# EAGLE design generator (EAGLE 7.2.0)
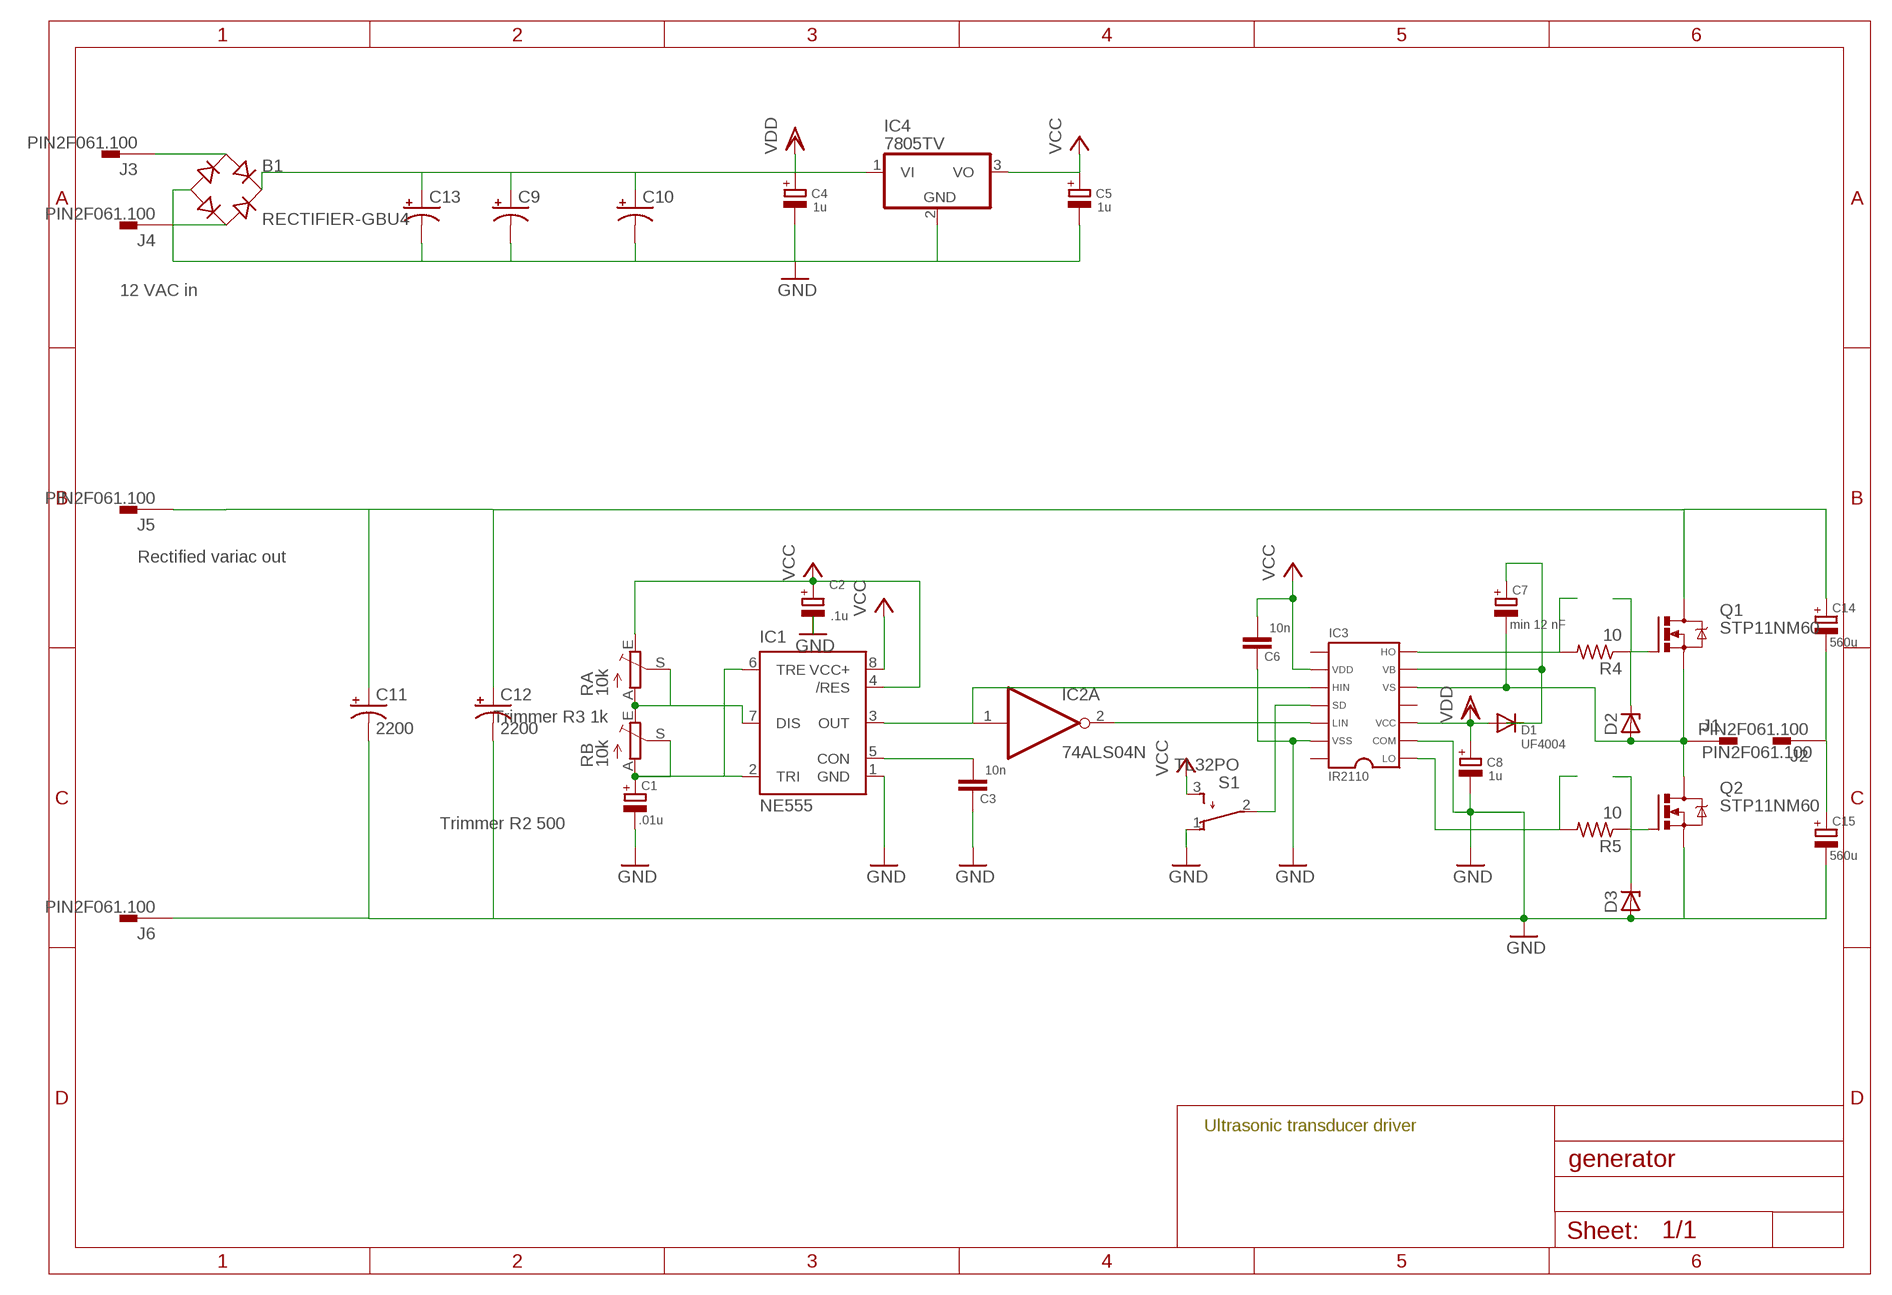
[diagram p0: schematic, sheet 1]

## Parts
B1  RECTIFIER-GBU4  [GBU4]
C1  .01u  CPOL-EUE5-8.5  [E5-8,5]
C2  .1u  CPOL-EUE5-8.5  [E5-8,5]
C3  10n  C-EU075-052X106  [C075-052X106]
C4  1u  CPOL-EUE5-8.5  [E5-8,5]
C5  1u  CPOL-EUE5-8.5  [E5-8,5]
C6  10n  C-EU075-052X106  [C075-052X106]
C7  min 12 nF  CPOL-EUE5-8.5  [E5-8,5]
C8  1u  CPOL-EUE5-8.5  [E5-8,5]
C9  CPOL-USE7.5-18  [E7,5-18]
C10  CPOL-USE7.5-18  [E7,5-18]
C11  2200  CPOL-USE10-35  [EB35D]
C12  2200  CPOL-USE10-35  [EB35D]
C13  CPOL-USE7.5-18  [E7,5-18]
C14  560u  CPOL-EUE7.5-16  [E7,5-16]
C15  560u  CPOL-EUE7.5-16  [E7,5-16]
D1  UF4004  DIODE-D-7.5  [D-7.5]
D2  ZENER-DIODEZD-10  [ZDIO-10]
D3  ZENER-DIODEZD-10  [ZDIO-10]
IC1  NE555  [DIL-08]
IC2  74ALS04N  [DIL14]
IC3  IR2110  [DIL14]
IC4  7805TV  [TO220V]
J1  PIN2F061.100  [F061.100]
J2  PIN2F061.100  [F061.100]
J3  PIN2F061.100  [F061.100]
J4  PIN2F061.100  [F061.100]
J5  PIN2F061.100  [F061.100]
J6  PIN2F061.100  [F061.100]
Q1  STP11NM60  IRF530  [TO220BV]
Q2  STP11NM60  IRF530  [TO220BV]
R4  10  R-US_0207/10  [0207/10]
R5  10  R-US_0207/10  [0207/10]
RA  10k  TRIM_EU-LI10  [LI10]
RB  10k  TRIM_EU-LI10  [LI10]
S1  TL32PO  [TL3XPO]

## Nets
GND: B1.- C1.- C2.- C3.1 C4.- C5.- C6.1 C8.- C9.- C10.- C11.- C12.- C13.- C15.- D3.A IC1.1(GND) IC3.2 IC3.13 IC4.2(GND) J6.A1 J6.A2 Q2.S S1.1(O)
HIN: IC1.3(OUT) IC2.1(A:I) IC3.10
HO: IC3.7 R4.2
LIN: IC2.2(A:O) IC3.12
LO: IC3.1 R5.2
N$1: C7.+ D1.C IC3.6
N$2: C1.+ IC1.2(TRI) IC1.6(TRE) RB.A RB.S
N$3: C3.2 IC1.5(CON)
N$6: C11.+ C12.+ C14.+ J5.A1 J5.A2 Q1.D
N$7: IC1.7(DIS) RA.A RA.S RB.E
N$8: C14.- C15.+ J2.A1 J2.A2
N$9: B1.AC2 J4.A1 J4.A2
N$10: B1.AC1 J3.A1 J3.A2
N$11: D3.C Q2.G R5.1
N$12: D2.C Q1.G R4.1
N$17: IC3.11 S1.2(P)
TRANS: C7.- D2.A IC3.5 J1.A1 J1.A2 Q1.S Q2.D
VCC: C2.+ C5.+ C6.2 IC1.4(/RES) IC1.8(VCC+) IC3.9 IC4.3(VO) RA.E S1.3(S)
VDD: B1.+ C4.+ C8.+ C9.+ C10.+ C13.+ D1.A IC3.3 IC4.1(VI)
Unconnected: IC2.3(B:I) IC2.4(B:O) IC2.5(C:I) IC2.6(C:O) IC2.8(D:O) IC2.9(D:I) IC2.10(E:O) IC2.11(E:I) IC2.12(F:O) IC2.13(F:I) IC3.4 IC3.8 IC3.14

## Notes on the sheet
- 12 VAC in
- Rectified variac out
- Trimmer R3 1k
- Trimmer R2 500
- Ultrasonic transducer driver

## Power pins joined to a net without a drawn wire
GND: IC2.7(P:GND)
VCC: IC2.14(P:VCC)

## Library data of the parts
B1 = rectifier:RECTIFIER-: Rectifier
C1 C2 C4 C5 C7 C8 C14 C15 = rcl:CPOL-EU: POLARIZED CAPACITOR, European symbol
C3 C6 = rcl:C-EU: CAPACITOR, European symbol
C9-C13 = resistor:CPOL-US: POLARIZED CAPACITOR, American symbol
D1 = diode:DIODE-: DIODE
D2 D3 = diode:ZENER-DIODE: Z-Diode
IC1 = st-microelectronics:NE555: General purpose bipolar Timer; MF: Arrow Electronics; MPN: NE555N; OC_FARNELL: 1467742; OC_NEWARK: 89K1486
IC2 = 74xx-us:74*04: Hex INVERTER
IC3 = lindsay-mosfet-driver:IR2110
IC4 = linear:78*: Positive VOLTAGE REGULATOR Source: http://cache.national.com/ds/LM/LM78L05.pdf http://www.fairchildsemi.com/ds/LM/LM7805.pdf
J1-J6 = con-faston:PIN2: Flachstecker Typ Tyco/Electronics/AMP TAB, FASTON Printed Circuit Board Tabs Source: http://www.buerklin.com, http://catalog.tycoelectronics.com; OC_FARNELL: unknown; OC_NEWARK: unknown
Q1 Q2 = transistor-power:IRF530: HEXFET Power MOSFET
R4 R5 = rcl:R-US_: RESISTOR, American symbol
RA RB = pot:TRIM_EU-: POTENTIOMETER
S1 = switch:TL32PO: TINY SWITCH ON - MOM Source: http://www2.produktinfo.conrad.com/datenblaetter/700000-724999/705152-da-01-de-Subminiaturschalter_TL_36YO.pdf

## Board
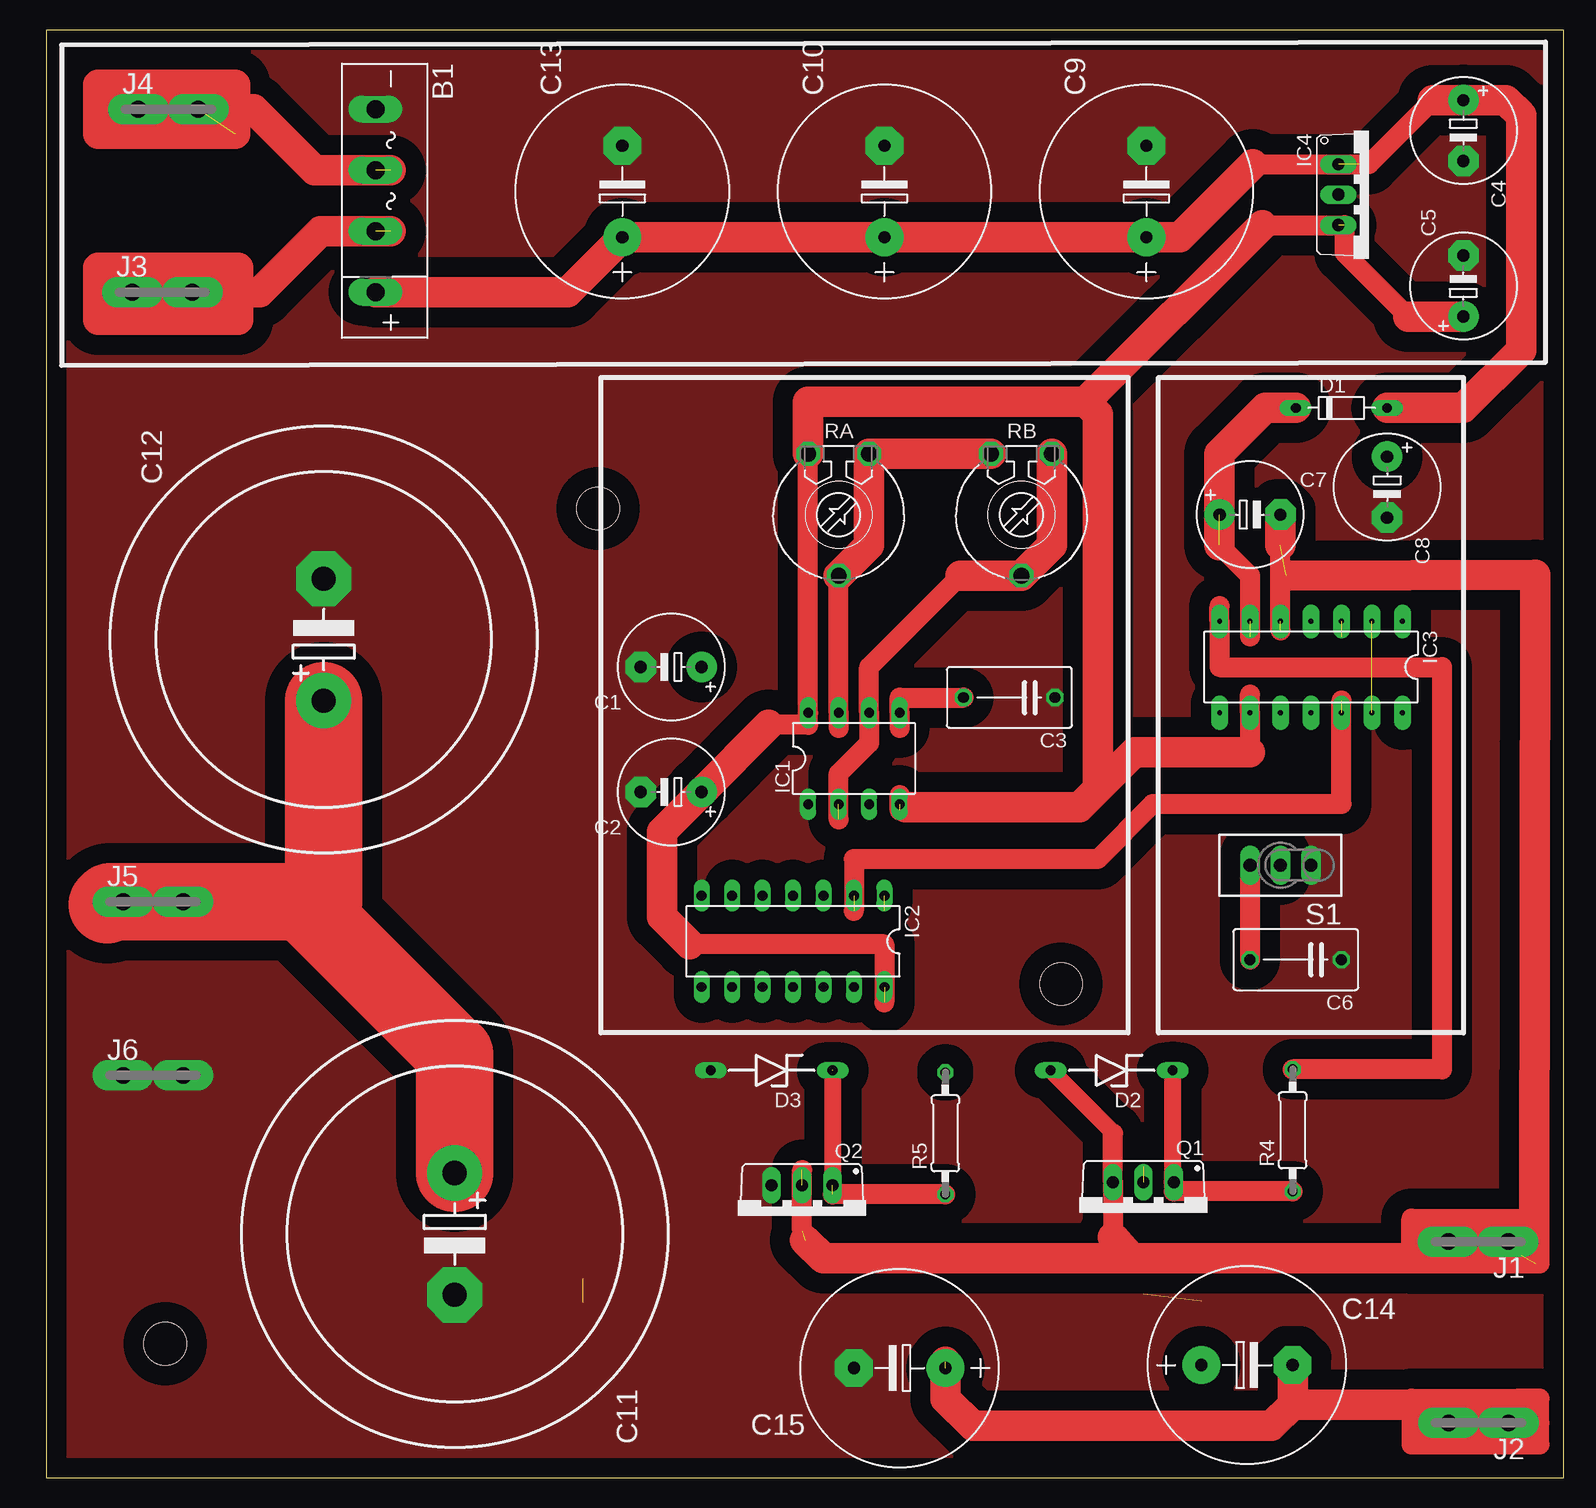
[diagram p1: board, top side]
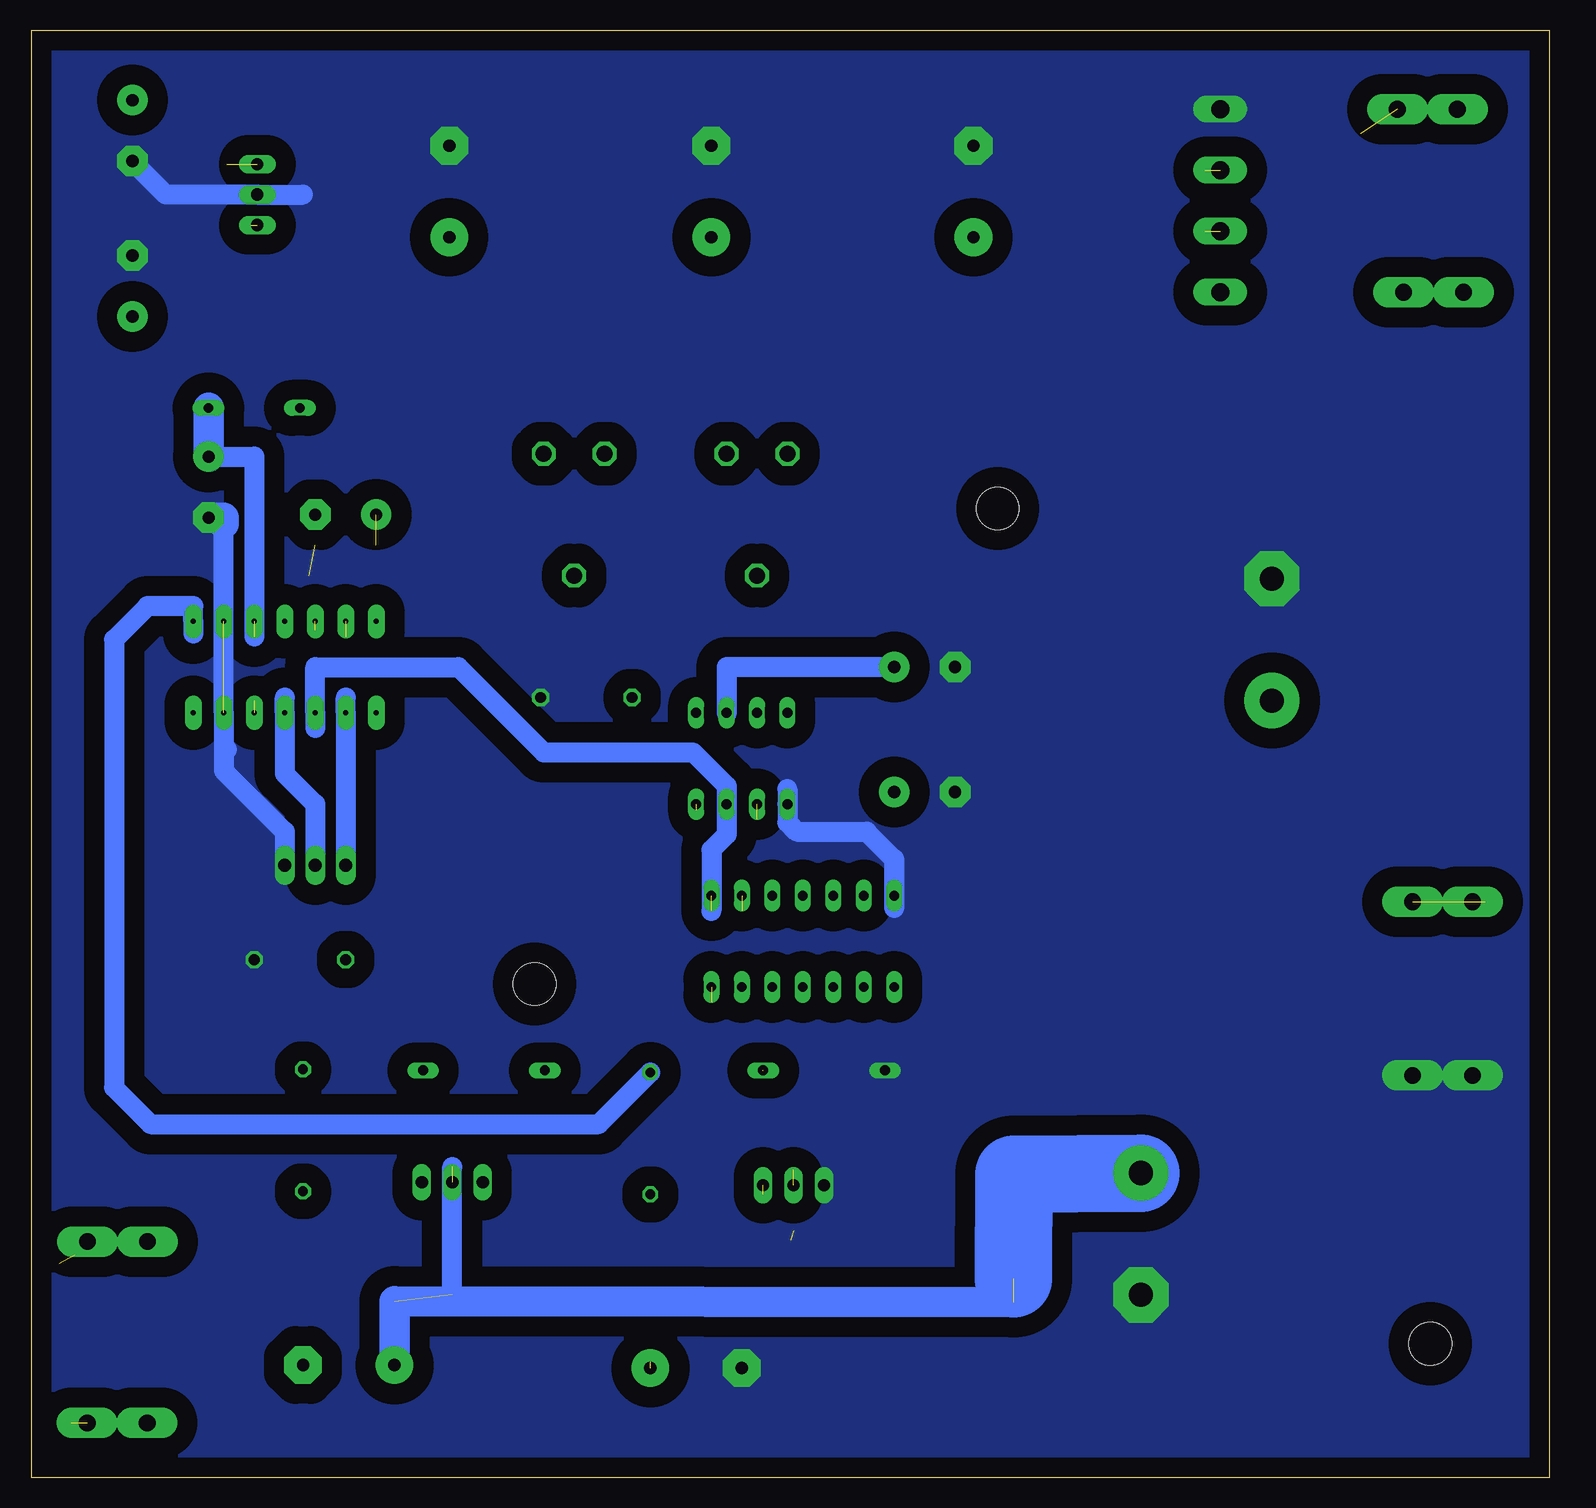
[diagram p2: board, bottom side, seen from below]

Size 126.49 x 120.65 mm. Coordinates in mm from the lower left corner, seen from the top.
Outline: 0,0 126.49,0 126.49,120.65 0,120.65 0,0
Copper layers (1*16): Top 0.035mm / dielectric 1.5mm / Bottom 0.035mm
Design rules "default *": minimum track width 10mil, minimum drill 24mil, track to track 8mil, track to pad 8mil, pad to pad 8mil, via to via 8mil, smd to smd 8mil, copper to edge 5mil, drill to drill 8mil, minimum pad ring 10mil, minimum via ring 8mil, stop-mask expansion 4mil, vias tented up to drill 0mil, thermal gap 10mil
Holes 3.56 mm at 9.91,11.18 45.97,80.77 84.58,41.15

### Footprints (pad centres in the part's own frame; a part is rotated, then mirrored left to right if it is on the bottom)
GBU4 = drill 1.499 long: + 7.62,0; - -7.62,0; AC1 2.54,0; AC2 -2.54,0
E5-8,5 = drill 1.016 pad 2.54: + -2.54,0 | drill 1.016 pad 2.54 octagon: - 2.54,0
C075-052X106 = drill 0.914 octagon: 1 -3.81,0; 2 3.81,0
E7,5-18 = drill 1.016 pad 3.15: + -3.81,0 | drill 1.016 pad 3.15 octagon: - 3.81,0
EB35D = drill 2.007 pad 4.597: + -5.08,0 | drill 2.007 pad 4.597 octagon: - 5.08,0
E7,5-16 = drill 1.016 pad 3.15: + -3.81,0 | drill 1.016 pad 3.15 octagon: - 3.81,0
D-7.5 = drill 0.813 long: A 3.81,0; C -3.81,0
ZDIO-10 = drill 0.813 long: A 5.08,0; C -5.08,0
DIL-08 = drill 0.813 long: 1 -3.81,-3.81; 2 -1.27,-3.81; 3 1.27,-3.81; 4 3.81,-3.81; 5 3.81,3.81; 6 1.27,3.81; 7 -1.27,3.81; 8 -3.81,3.81
DIL14 = drill 0.813 long: 1 -7.62,-3.81; 2 -5.08,-3.81; 3 -2.54,-3.81; 4 0,-3.81; 5 2.54,-3.81; 6 5.08,-3.81; 7 7.62,-3.81; 8 7.62,3.81; 9 5.08,3.81; 10 2.54,3.81; 11 0,3.81; 12 -2.54,3.81; 13 -5.08,3.81; 14 -7.62,3.81
DIL14' = drill 0.406 pad 1.422 long: 1 -7.62,-3.81; 2 -5.08,-3.81; 3 -2.54,-3.81; 4 0,-3.81; 5 2.54,-3.81; 6 5.08,-3.81; 7 7.62,-3.81; 8 7.62,3.81; 9 5.08,3.81; 10 2.54,3.81; 11 0,3.81; 12 -2.54,3.81; 13 -5.08,3.81; 14 -7.62,3.81
TO220V = drill 1.016 long: 1 -2.54,-2.54; 2 0,-2.54; 3 2.54,-2.54
F061.100 = drill 1.4 pad 2.54 long: A1 -2.5,0; A2 2.5,0
TO220BV = drill 1.016 long: D 0,-2.54; G -2.54,-2.54; S 2.54,-2.54
0207/10 = drill 0.813 octagon: 1 -5.08,0; 2 5.08,0
LI10 = drill 1.321 octagon: A -2.54,-5.08; E 2.54,-5.08; S 0,5.08
TL3XPO = drill 1.1 pad 1.422 long: 1 -2.54,0; 2 0,0; 3 2.54,0

### Placement (x,y rotation side)
B1  27.43,106.43 270 top
C1  52.07,67.56 180 top
C2  52.07,57.15 180 top
C3  80.26,65.02 180 top
C4  118.11,112.27 270 top
C5  118.11,99.31 90 top
C6  104.14,43.18 180 top
C7  100.33,80.26 0 top
C8  111.76,82.55 270 top
C9  91.69,107.19 90 top
C10  69.85,107.19 90 top
C11  34.04,20.32 270 top
C12  23.11,69.85 90 top
C13  48.01,107.19 90 top
C14  100.08,9.4 0 top
C15  71.12,9.14 180 top
D1  107.95,89.15 0 top
D2  88.8,33.96 180 top
D3  60.45,33.96 180 top
IC1  67.31,59.94 0 top
IC2  62.23,44.7 180 top
IC3  IR2110  [DIL14']  105.41,67.56 180 top
IC4  110.24,106.93 270 top
J1  119.35,19.69 180 top
J2  119.38,4.57 180 top
J3  9.65,98.81 0 top
J4  10.16,114.05 0 top
J5  8.89,48.01 0 top
J6  8.89,33.53 0 top
Q1  91.44,22.1 180 top
Q2  62.99,21.84 180 top
R4  103.89,28.96 90 top
R5  74.93,28.7 90 top
RA  66.04,80.26 180 top
RB  81.28,80.26 180 top
S1  102.87,51.05 180 top

### Tracks (layer width: path | path; a pad name or v marks a point on that pad's centre or on a via)
GND  (1 unrouted)
  Bottom 1.676: 110.49,79.5 IC3.13 110.49,58.93 105.41,53.85 105.41,50.29 | C4.- 115.32,106.93 IC4.2 103.89,106.93 | 63.5,57.4 IC1.1 63.5,54.61 62.74,53.85 56.9,53.85 54.61,51.56 54.61,47.5 | 110.49,60.71 110.24,60.71
  Bottom 2.54: 110.49,79.5 110.49,80.01 C8.-
  pour Bottom (isolate 1.676, no thermals): 0.25,120.4 126.24,120.4 126.24,0 0.25,0
  pour Top (isolate 1.676, no thermals): 0.25,120.4 126.49,120.4 126.49,0 0.25,0
HIN  (1 unrouted)
  Bottom 1.676: 69.85,47.24 69.85,52.32 68.58,53.59 IC1.3 68.58,57.66 71.37,60.45 83.82,60.45 90.93,67.56 102.87,67.56 IC3.10 102.87,62.48
HO
  Top 1.676: 97.79,72.64 IC3.7 97.79,67.56 116.33,67.56 116.33,34.04 R4.2
LIN  (2 unrouted)
  Top 1.676: 67.31,47.24 67.31,51.56 87.63,51.56 92.2,56.13 107.95,56.13 107.95,64.77
LO
  Bottom 1.676: 113.03,70.36 IC3.1 113.03,72.64 116.84,72.64 119.63,69.85 119.63,32.51 116.59,29.46 79.25,29.46 R5.2
N$1  (2 unrouted)
  Top 1.676: 97.79,77.72 100.33,75.18 100.33,70.1
  Top 2.54: D1.C 101.6,89.15 97.79,85.34 97.79,77.72
N$2  (1 unrouted)
  Top 1.676: 66.04,54.86 66.04,58.67 68.58,61.21 IC1.6 68.58,67.56 76.2,75.18
  Top 2.54: 76.2,75.18 RB.S 83.82,77.72 RB.A
  Bottom 1.676: C1.+ 68.58,67.56 IC1.6
N$3
  Top 1.676: 71.12,62.48 IC1.5 71.12,65.02 C3.2
N$6  (5 unrouted)
  Top 6.452: C12.+ 23.11,48.01 21.34,48.01 | 21.34,48.01 5.33,48.01 5.08,47.75 | 21.34,48.01 34.04,35.31 C11.+
  Bottom 1.676: 91.44,15.29 91.44,25.91
  Bottom 2.54: C14.+ 96.27,14.73 44.68,14.63
  Bottom 6.452: C11.+ 44.63,25.3 44.68,16.59
N$7
  Top 1.676: 66.04,62.48 IC1.7 RA.S
  Top 2.54: RA.S 68.58,77.72 RA.A RB.E
N$8  (2 unrouted)
  Top 1.676: 124.46,4.57 123.19,4.57 115.04,4.57 115.04,4.09 115.93,4.09 115.93,3.76 | 124.46,4.57 124.46,6.6 122.68,6.6 | 113.79,5.84 113.79,2.79 124.46,2.79 124.46,4.57 | 115.32,6.1 113.79,5.84 | 113.79,5.84 113.79,6.6 122.68,6.6 | 122.68,6.6 123.19,6.1
  Top 2.54: C14.- 103.89,6.1 | 103.89,6.1 102.11,4.32 77.22,4.32 74.93,6.6 74.93,9.65 | 103.89,6.1 115.32,6.1 J2.A2 123.19,4.57
N$9  (2 unrouted)
  Top 2.54: 28.7,108.97 22.35,108.97 17.27,114.05 J4.A1 4.57,114.05 4.57,112.01 15.75,112.01 15.75,116.08 4.32,116.08 4.32,112.01
N$10  (1 unrouted)
  Top 2.54: J3.A1 J3.A2 | J3.A2 17.78,98.81 22.86,103.89 28.7,103.89 | J3.A2 4.32,98.81 | 4.32,98.81 4.32,100.84 16,100.84 16,96.52 4.32,96.52 4.32,98.81
N$11  (2 unrouted)
  Top 1.422: Q2.G 65.56,24.38 65.56,33.91
  Top 1.676: R5.1 65.53,23.62
N$12
  Top 1.422: Q1.G 93.88,24.64 D2.C
  Top 1.676: Q1.G 93.98,23.88 R4.1
N$17
  Bottom 1.676: 105.41,65.02 IC3.11 105.41,58.67 102.87,56.13 S1.2
TRANS  (5 unrouted)
  Top 1.422: 88.9,28.7 88.9,28.78 D2.A
  Top 1.676: 102.87,70.61 102.87,77.72 | 88.9,28.7 Q1.S 88.9,20.07 | 115.06,19.56 123.95,19.56 124.21,19.81 124.21,17.86 | 124.21,17.86 114.81,17.86 | 114.81,17.86 113.79,17.86 113.79,21.59 124.46,21.59 124.46,17.86 124.21,17.86 | 114.81,17.86 114.81,20.57 123.19,20.57 124.03,20.19 | J1.A2 117.09,19.81 118.36,18.54 122.94,18.54 | 62.99,20.57 62.99,25.65
  Top 2.54: C7.- 102.87,77.72 | 103.38,75.18 124.1,75.26 124.03,20.19 123.44,20.07 J1.A1 | 88.9,20.07 90.42,18.29 | 90.42,18.29 115.06,18.29 115.06,19.56 | 90.42,18.29 64.77,18.29 63.25,19.81
VCC  (3 unrouted)
  Top 1.676: 60.2,62.74 63.5,62.74 IC1.8 RA.E | 71.63,55.88 71.12,55.63 71.12,56.9 | 53.59,44.45 69.85,44.45 69.85,39.62 | C2.+ 56.13,58.67 | S1.3 C6.2 | 100.33,65.28 IC3.9 100.33,60.45 | 101.35,104.39 108.2,104.39 108.2,102.11 113.54,96.77
  Top 2.54: 60.2,62.74 C2.+ 51.31,53.85 51.31,46.74 53.59,44.45 | 86.61,89.66 63.5,89.66 RA.E | 86.61,89.66 87.63,88.65 87.63,57.4 | 87.63,57.4 86.11,55.88 71.63,55.88 | 87.63,57.4 90.68,60.45 100.33,60.45 | 86.61,89.66 101.35,104.39 | 113.54,96.77 C5.+
  Bottom 1.676: 100.33,65.02 IC3.9 S1.3
VDD  (2 unrouted)
  Top 1.676: 100.58,109.47 110.24,109.47 115.57,114.81
  Top 2.54: 100.58,109.47 94.49,103.38 C9.+ C10.+ C13.+ 43.43,98.81 B1.+ | 115.57,114.81 C4.+ 121.67,114.81 122.94,113.54 122.94,93.98 118.11,89.15 D1.A
  Bottom 1.676: C8.+ 107.95,85.09 107.95,70.1
  Bottom 2.54: D1.A C8.+